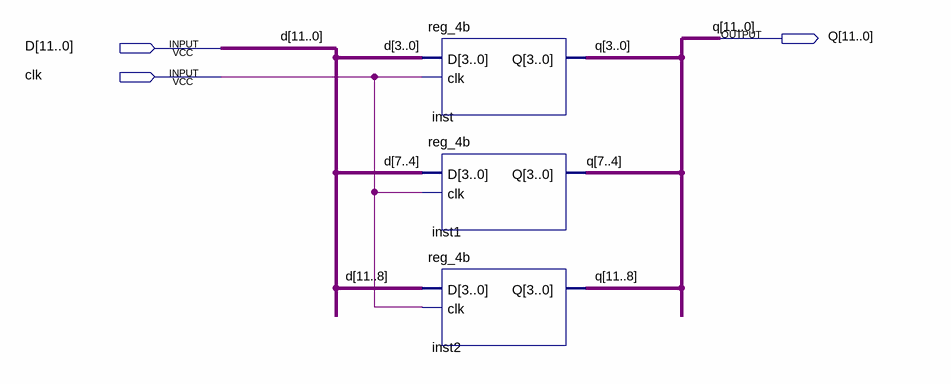
[diagram p0: schematic sheet]
// Quartus schematic reg_12b.bdf as structural Verilog: 3 symbols, 3 pins
module reg_12b (
  input  [11:0] D,
  input  clk,
  output [11:0] Q
);

  reg_4b inst (.D(D[3:0]), .clk(clk), .Q(Q[3:0]));
  reg_4b inst1 (.D(D[7:4]), .clk(clk), .Q(Q[7:4]));
  reg_4b inst2 (.D(D[11:8]), .clk(clk), .Q(Q[11:8]));
endmodule
